# EasyEDA Pro project PCB.eprj, board Instruction_Register
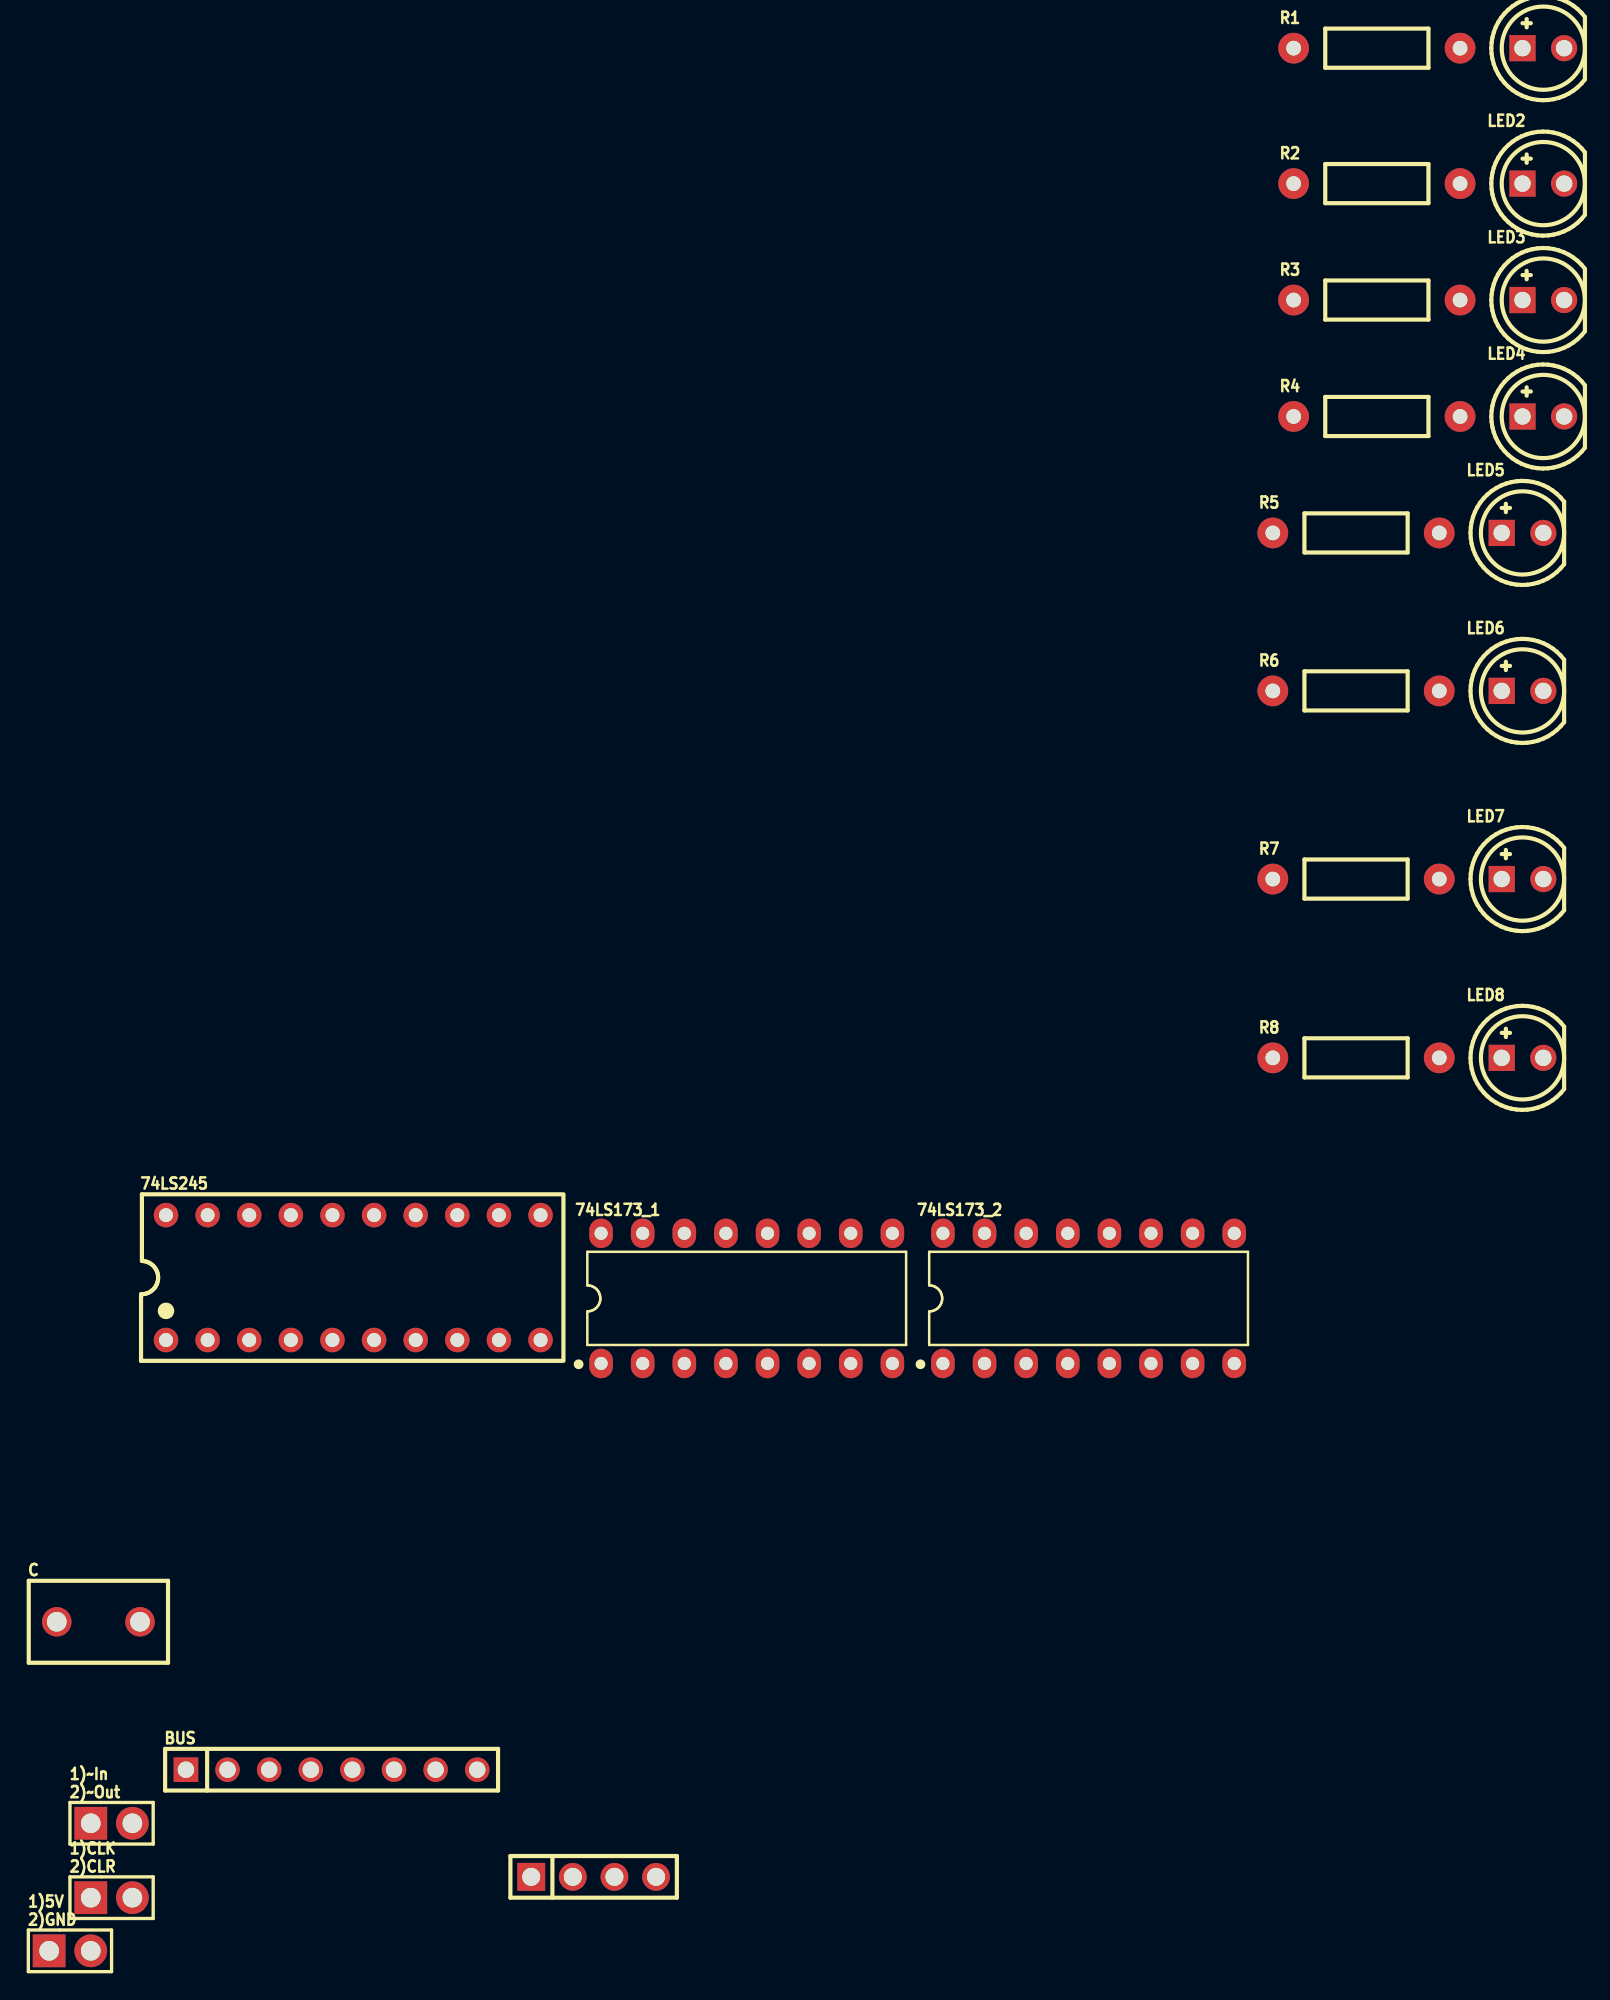
[diagram p8: board, top side]
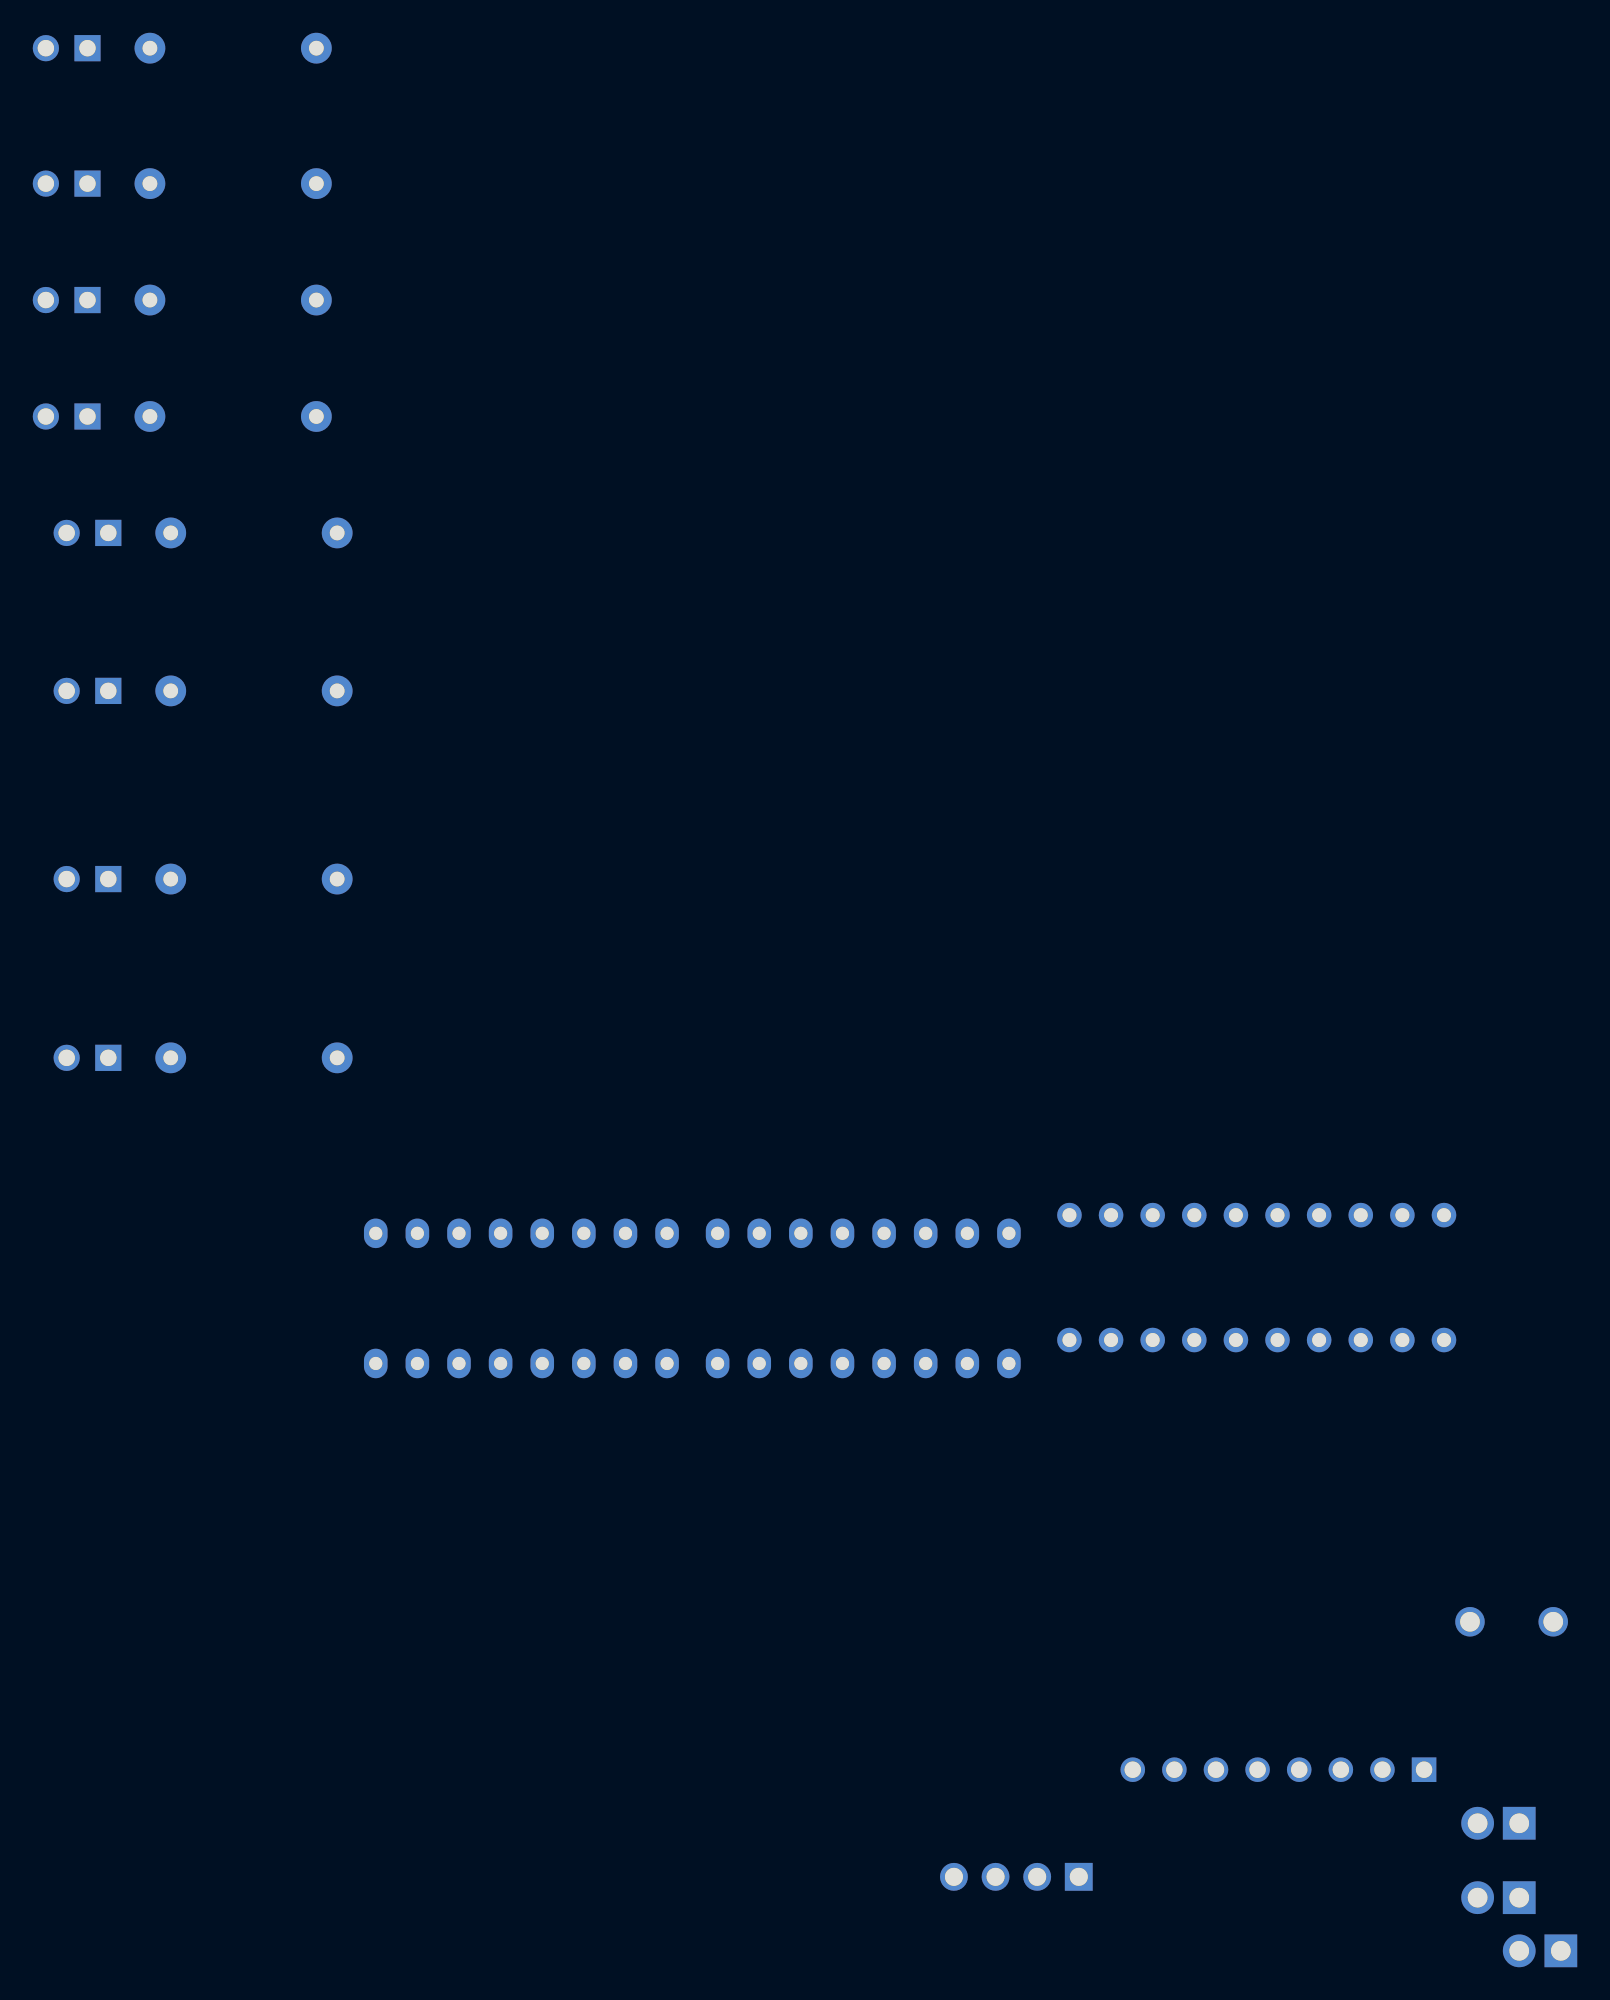
[diagram p9: board, bottom side, seen from below]

No outline. copper layers: Top Layer, Bottom Layer. Coordinates in mm from the lowest, leftmost part position.
Stack: Top Layer 0.035mm / Dielectric1 1.51mm FR4 er 4.5 / Bottom Layer 0.035mm

## Design rules (mm)
template: JLCPCB Capability(Two Layers Board)
spacing copperThickness1oz (default): track to track 0.102, other pairs 0.152 to 0.3
spacing copperThickness2oz: track to track 0.203, other pairs 0.152 to 0.3
track width copperThickness1oz (default): min 0.127, default 0.254, max 2.54
track width copperThickness2oz: min 0.203, default 0.254, max 2.54
differential pair differentialPair (default): width min 0.127, default 0.254, max 2.54; gap min 0.152, default 0.152
via viaSize (default): diameter min 0.5, default 0.61, max 10; hole min 0.3, default 0.305, max 6.3

## Placement (name value [footprint] x y rotation side)
1)5V
2)GND  PZ254V-11-02P  [HDR-TH_2P-P2.54-V-M]  0 0 0 top
1)CLK
2)CLR  PZ254V-11-02P  [HDR-TH_2P-P2.54-V-M]  2.54 3.24 0 top
1)~In
2)~Out  PZ254V-11-02P  [HDR-TH_2P-P2.54-V-M]  2.54 7.78 0 top
74LS173_1  SN74LS173AN  [PDIP-16_L19.3-W6.4-P2.54-LS7.94-BL]  41.31 39.8 0 top
74LS173_2  SN74LS173AN  [PDIP-16_L19.3-W6.4-P2.54-LS7.94-BL]  62.17 39.8 0 top
74LS245  SN74LS245N  [DIP-20_L25.5-W10.0-P2.54-LS7.6-BL]  17.29 41.07 0 top
BUS  PZ254V-11-08P  [HDR-TH_8P-P2.54-V-M]  15.97 11.05 0 top
C  100nF  [CAP-TH_L8.5-W5.0-P5.00-D1.2]  1.74 20.07 0 top
LED1  -  [LED-TH_BD5.8-P2.54-FD]  89.93 116.08 0 top
LED2  -  [LED-TH_BD5.8-P2.54-FD]  89.93 107.82 0 top
LED3  -  [LED-TH_BD5.8-P2.54-FD]  89.93 100.71 0 top
LED4  -  [LED-TH_BD5.8-P2.54-FD]  89.93 93.61 0 top
LED5  -  [LED-TH_BD5.8-P2.54-FD]  88.66 86.5 0 top
LED6  -  [LED-TH_BD5.8-P2.54-FD]  88.66 76.87 0 top
LED7  -  [LED-TH_BD5.8-P2.54-FD]  88.66 65.39 0 top
LED8  -  [LED-TH_BD5.8-P2.54-FD]  88.66 54.48 0 top
NOREF  -  [HDR-TH_4P-P2.54-V-M]  31.96 4.51 0 top
R1  220  [R_AXIAL-0.4]  79.77 116.08 0 top
R2  220  [R_AXIAL-0.4]  79.77 107.82 0 top
R3  220  [R_AXIAL-0.4]  79.77 100.71 0 top
R4  220  [R_AXIAL-0.4]  79.77 93.61 0 top
R5  220  [R_AXIAL-0.4]  78.5 86.5 0 top
R6  220  [R_AXIAL-0.4]  78.5 76.87 0 top
R7  220  [R_AXIAL-0.4]  78.5 65.39 0 top
R8  220  [R_AXIAL-0.4]  78.5 54.48 0 top

## Footprints (pads in the part's own frame, mm; a bottom-side part is the same pattern mirrored in y, then rotated)
CAP-TH_L8.5-W5.0-P5.00-D1.2
  round 1.8 hole 1.2: 1(-2.54,0) 2(2.54,0)
DIP-20_L25.5-W10.0-P2.54-LS7.6-BL
  round 1.5 hole 0.85: 1(-11.43,-3.81) 2(-8.89,-3.81) 3(-6.35,-3.81) 4(-3.81,-3.81) 5(-1.27,-3.81) 6(1.27,-3.81) 7(3.81,-3.81) 8(6.35,-3.81) 9(8.89,-3.81) 10(11.43,-3.81) 11(11.43,3.81) 12(8.89,3.81) 13(6.35,3.81) 14(3.81,3.81) 15(1.27,3.81) 16(-1.27,3.81) 17(-3.81,3.81) 18(-6.35,3.81) 19(-8.89,3.81) 20(-11.43,3.81)
HDR-TH_2P-P2.54-V-M
  rect 2x2 hole 1.2: 1(-1.27,0)
  round 2 hole 1.2: 2(1.27,0)
HDR-TH_4P-P2.54-V-M
  rect 1.7x1.7 hole 1.1: 1(-3.81,0)
  round 1.7 hole 1.1: 2(-1.27,0) 3(1.27,0) 4(3.81,0)
HDR-TH_8P-P2.54-V-M
  rect 1.5x1.5 hole 1: 1(-8.89,0)
  round 1.5 hole 1: 2(-6.35,0) 3(-3.81,0) 4(-1.27,0) 5(1.27,0) 6(3.81,0) 7(6.35,0) 8(8.89,0)
LED-TH_BD5.8-P2.54-FD
  rect 1.6x1.6 hole 1: 1(-1.27,0)
  round 1.6 hole 1: 2(1.27,0)
PDIP-16_L19.3-W6.4-P2.54-LS7.94-BL
  oval 1.44x1.8 hole 0.8: 1(-8.89,-3.97) 2(-6.35,-3.97) 3(-3.81,-3.97) 4(-1.27,-3.97) 5(1.27,-3.97) 6(3.81,-3.97) 7(6.35,-3.97) 8(8.89,-3.97) 9(8.89,3.97) 10(6.35,3.97) 11(3.81,3.97) 12(1.27,3.97) 13(-1.27,3.97) 14(-3.81,3.97) 15(-6.35,3.97) 16(-8.89,3.97)
R_AXIAL-0.4
  round 1.879 hole 0.899: 1(-5.08,0) 2(5.08,0)

## Nets
As in the schematic, except:
5: 74LS173_2.3 NOREF.1 R5.1
6: 74LS173_2.4 NOREF.2 R6.1
7: 74LS173_2.5 NOREF.3 R7.1
8: 74LS173_2.6 NOREF.4 R8.1
